# EAGLE schematic main-board (EAGLE 9.6.2)
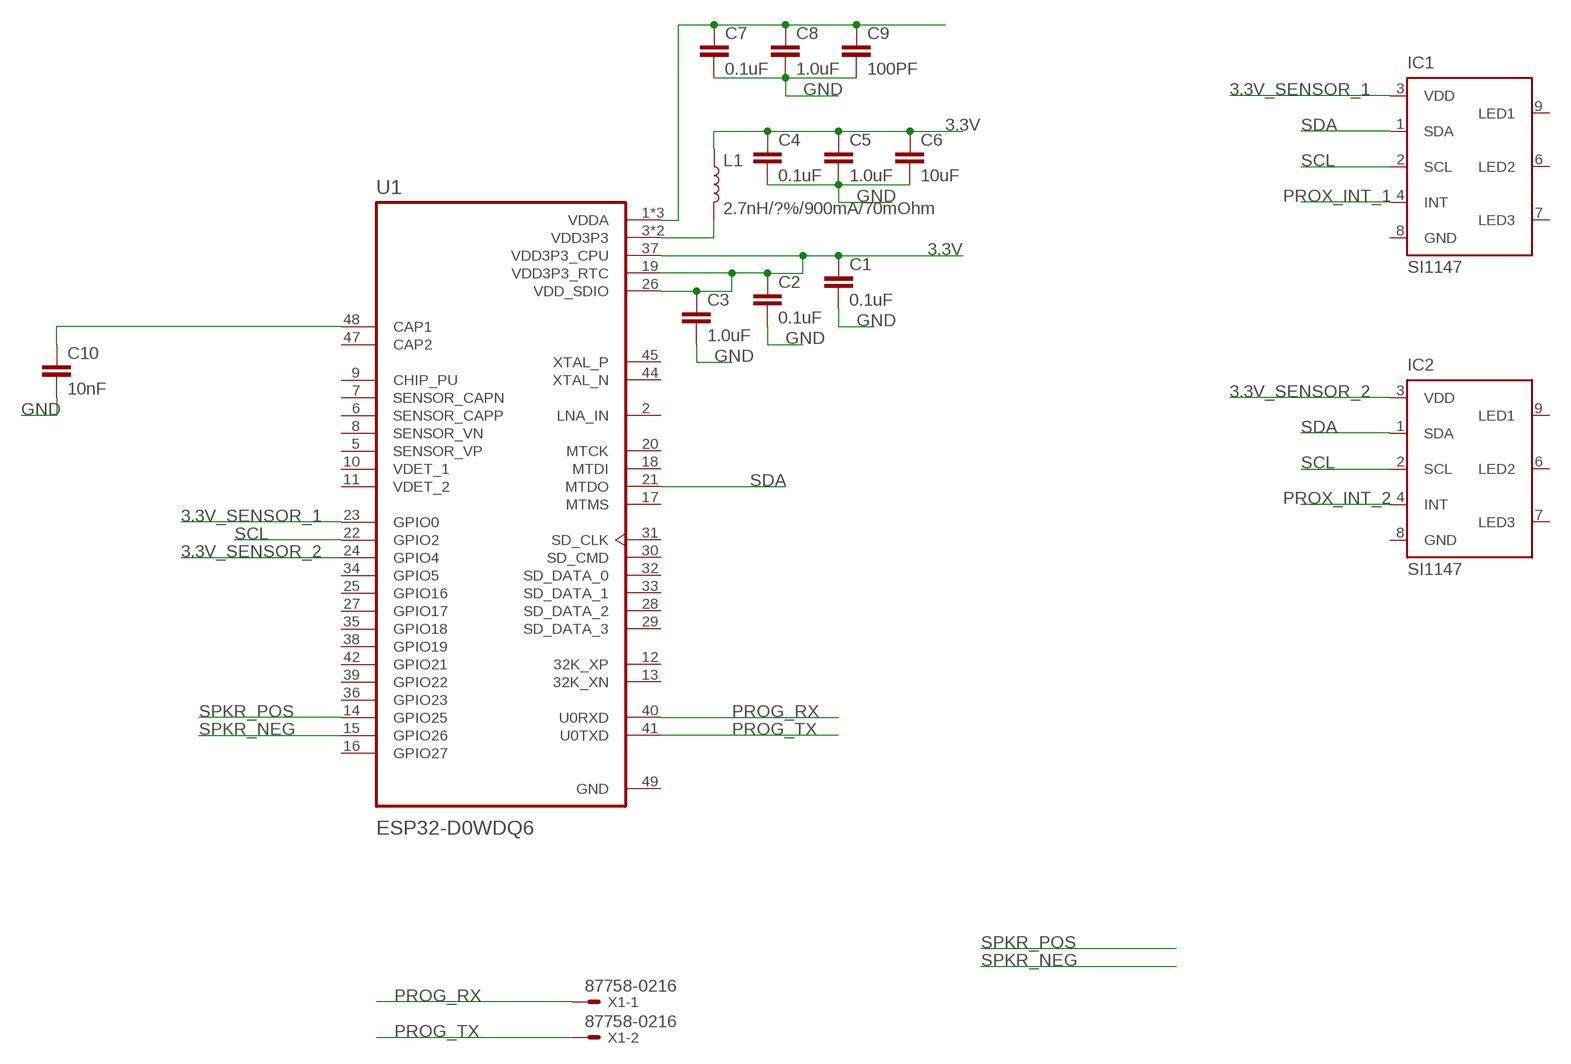
[diagram p0: schematic, sheet 1]

## Parts
C1  0.1uF  0.1UF-0603-25V-(+80/-20%)  [0603]
C2  0.1uF  0.1UF-0603-25V-(+80/-20%)  [0603]
C3  1.0uF  1.0UF-0603-16V-10%  [0603]
C4  0.1uF  0.1UF-0402-16V-10%  [0402]
C5  1.0uF  1.0UF-0402-16V-10%  [0402]
C6  10uF  10UF-0805-10V-10%  [0805]
C7  0.1uF  0.1UF-0402-16V-10%  [0402]
C8  1.0uF  1.0UF-0402-16V-10%  [0402]
C9  100PF  100PF-0402-50V-5%  [0402]
C10  10nF  10NF-0603-50V-10%  [0603]
IC1  SI1147  [QFN-10]
IC2  SI1147  [QFN-10]
L1  2.7nH/?%/900mA/70mOhm  INDUCTOR-0402_TIGHT-2.7NH  [0402-TIGHT]
U1  ESP32-D0WDQ6  [QFN35P500X500X90-49N]
X1  87758-0216  [87758-0216]

## Nets
3.3V: C1.1 C2.1 C3.1 C4.1 C5.1 C6.1 L1.1 U1.19(VDD3P3_RTC) U1.26(VDD_SDIO) U1.37(VDD3P3_CPU)
3.3V_SENSOR_1: IC1.3(VDD) U1.23(GPIO0)
3.3V_SENSOR_2: IC2.3(VDD) U1.24(GPIO4)
GND: C1.2 C2.2 C3.2 C4.2 C5.2 C6.2 C7.2 C8.2 C9.2 C10.2
N$1: C10.1 U1.48(CAP1)
N$2: C7.1 C8.1 C9.1 U1.1(VDDA) U1.43(VDDA) U1.46(VDDA)
N$3: L1.2 U1.3(VDD3P3) U1.4(VDD3P3)
PROG_RX: U1.40(U0RXD) X1.1
PROG_TX: U1.41(U0TXD) X1.2
PROX_INT_1: IC1.4(INT)
PROX_INT_2: IC2.4(INT)
SCL: IC1.2(SCL) IC2.2(SCL) U1.22(GPIO2)
SDA: IC1.1(SDA) IC2.1(SDA) U1.21(MTDO)
SPKR_NEG: U1.15(GPIO26)
SPKR_POS: U1.14(GPIO25)
Unconnected: IC1.6(LED2) IC1.7(LED3) IC1.9(LED1) IC2.6(LED2) IC2.7(LED3) IC2.9(LED1) U1.2(LNA_IN) U1.5(SENSOR_VP) U1.6(SENSOR_CAPP) U1.7(SENSOR_CAPN) U1.8(SENSOR_VN) U1.9(CHIP_PU) U1.10(VDET_1) U1.11(VDET_2) U1.12(32K_XP) U1.13(32K_XN) U1.16(GPIO27) U1.17(MTMS) U1.18(MTDI) U1.20(MTCK) U1.25(GPIO16) U1.27(GPIO17) U1.28(SD_DATA_2) U1.29(SD_DATA_3) U1.30(SD_CMD) U1.31(SD_CLK) U1.32(SD_DATA_0) U1.33(SD_DATA_1) U1.34(GPIO5) U1.35(GPIO18) U1.36(GPIO23) U1.38(GPIO19) U1.39(GPIO22) U1.42(GPIO21) U1.44(XTAL_N) U1.45(XTAL_P) U1.47(CAP2)

## Power pins joined to a net without a drawn wire
GND: IC1.8(GND) IC2.8(GND) U1.49(GND)

## Library data of the parts
C1 C2 = SparkFun-Capacitors:0.1UF: 0.1µF ceramic capacitors A capacitor is a passive two-terminal electrical component used to store electrical energy temporarily in an electric field.; PROD_ID: CAP-00810
C3 = SparkFun-Capacitors:1.0UF: 1µF ceramic capacitors A capacitor is a passive two-terminal electrical component used to store electrical energy temporarily in an electric field.; PROD_ID: CAP-00868
C4 C7 = SparkFun-Capacitors:0.1UF: 0.1µF ceramic capacitors A capacitor is a passive two-terminal electrical component used to store electrical energy temporarily in an electric field.; PROD_ID: CAP-12416
C5 C8 = SparkFun-Capacitors:1.0UF: 1µF ceramic capacitors A capacitor is a passive two-terminal electrical component used to store electrical energy temporarily in an electric field.; PROD_ID: CAP-12417
C6 = SparkFun-Capacitors:10UF: 10.0µF ceramic capacitors A capacitor is a passive two-terminal electrical component used to store electrical energy temporarily in an electric field.; PROD_ID: CAP-11330
C9 = SparkFun-Capacitors:100PF: 100pF/0.1nF ceramic capacitors A capacitor is a passive two-terminal electrical component used to store electrical energy temporarily in an electric field.; PROD_ID: CAP-13458
C10 = SparkFun-Capacitors:10NF: 0.01uF/10nF/10,000pF ceramic capacitors A capacitor is a passive two-terminal electrical component used to store electrical energy temporarily in an electric field. CAP-09321; PROD_ID: CAP-00867
IC1 IC2 = silabs:SI114*: PROXIMITY/UV/AMBIENT LIGHT SENSOR IC WITH I2C INTERFACE Source: http://www.silabs.com/Support%20Documents/TechnicalDocs/Si1145-46-47.pdf
L1 = SparkFun-Coils:INDUCTOR: Inductors Resist changes in electrical current. Basically a coil of wire. SparkFun Products: SparkFun Load Cell Amplifier - HX711 <https://www.sparkfun.com/products/13879> IOIO-OTG - V2.2 <https://www.sparkfun.com/products/13613>; PROD_ID: NDUC-14236
U1 = ESP32-D0WDQ6:ESP32-D0WDQ6: SoC; 2, 412G÷2, 484GHz; -98dBm; 2.2÷3.6VDC; SMD; QFN48; 19.5dBm; 16MB; AVAILABILITY: Unavailable; DESCRIPTION: IC RF TxRx + MCU Bluetooth, WiFi 802.11b/g/n, Bluetooth 4.2 2.412GHz ~ 2.484GHz 48-VFQFN Exposed Pad; MF: Espressif Systems; MP: ESP32-D0WDQ6; PACKAGE: VFQFN-48 Espressif Systems; PRICE: None
X1 = con-molex:87758-0216: 2 Pin - 2mm Dual Row Single Wafer, Vertical T/H HDR Source: http://www.molex.com/pdm_docs/sd/877580616_sd.pdf; MF: MOLEX; MPN: 87758-0216; OC_FARNELL: unknown; OC_NEWARK: 94M1513